# Altium schematic sheet Power regulators.SchDoc
size A; SheetNumber: 1
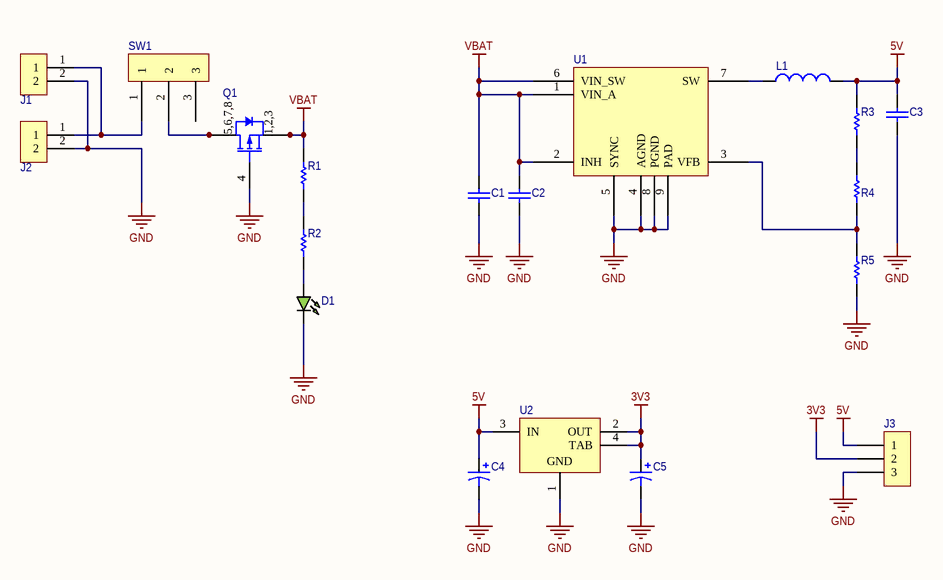
[diagram p0: Power regulators.SchDoc]

## Parts
C1  Kemet C1206C475K3RACAUTO  [CAPC3216X180X50ML20T25]  (value not drawn)
C2  Kemet C1206C104K5RACAUTO  [CAPC3216X88X50ML20T25]  (value not drawn)
C3  Kemet C1210C226K4PAC7800  [CAPC3225X205X50ML20T25]  (value not drawn)
C4  Cap Pol2  [PCB-2utroa4rb2vd9is4ckmk-1]  (value not drawn)
C5  Cap Pol2  [PCB-2utroa4rb2vd9is4ckmk-1]  (value not drawn)
D1  LTST-C170KGKT  [CHIPLED  0805]  (value not drawn)
J1  TE   647676-2  [PCB-kypnbpwjlxn1m6lvhwgg-1]  (value not drawn)
J2  TE   647676-2  [PCB-kypnbpwjlxn1m6lvhwgg-1]  (value not drawn)
J3  Molex 75757-0431  [Molex 75757-0431]  (value not drawn)
L1  RLF7030T-3R3M4R1  [INDC7922X32N]  (value not drawn)
Q1  SYM-000bc976ee97dfcc-1  [PCB-o8kpmntap7p5mqdjohts-1]  (value not drawn)
R1  Vishay Dale CRCW12061K00FKEB  [RESC3216X60X45ML10T20]  (value not drawn)
R2  Vishay Dale CRCW12061K00FKEB  [RESC3216X60X45ML10T20]  (value not drawn)
R3  Vishay CRCW1206100KFKEA  [PCB-76kjjvsvnrmyxpejc0rn-1]  (value not drawn)
R4  Vishay Dale CRCW12065K10FKEA  [RESC3216X60X45ML10T20]  (value not drawn)
R5  Vishay Dale CRCW120620K0FKTA  [RESC3216X60X45ML10T20]  (value not drawn)
SW1  Canal Components SL19-121  [PCB-btjqrve0936pn890qe86-1]  (value not drawn)
U1  ST1S10  [PCB-q7tc9tlrfg8r6x64pd1q-1]  (value not drawn)
U2  LM1117IMPX-3.3/NOPB  [MP04A_N]  (value not drawn)

## Nets
3V3: C5.1 J3.2 U2.2(OUT) U2.4(TAB)
5V: C3.1 C4.1 J3.1 L1.2 R3.2 U2.3(IN)
GND: C1.2 C2.2 C3.2 C4.2 C5.2 D1.1(K) J1.2 J2.2 J3.3 Q1.4(G) R5.2 U1.4(AGND) U1.5(SYNC) U1.8(PGND) U1.9(PAD) U2.1(GND)
VBAT: C1.1 C2.1 Q1.1(S) Q1.2(S) Q1.3(S) R1.1 U1.1(VIN_A) U1.2(INH) U1.6(VIN_SW)
NetD1_2: D1.2(A) R2.2
NetJ1_1: J1.1 J2.1 SW1.1
NetL1_1: L1.1 U1.7(SW)
NetQ1_5: Q1.5(D) Q1.6(D) Q1.7(D) Q1.8(D) SW1.2
NetR1_2: R1.2 R2.1
NetR3_1: R3.1 R4.2
NetR4_1: R4.1 R5.1 U1.3(VFB)

Not connected (* = marked no-connect by the designer): SW1 3

## Notes on the sheet
- (in symbol FDS4141) 5,6,7,8; 1,2,3

## Library data of the parts
C1 = C1206C475K3RACAUTO: CAPACITOR, 1206, X7R, 25V, 4.7UF; Capacitance: 4.7e-06 F; Capacitance Tolerance: ±10%; Dielectric Material: Ceramic; Lead-Free Status: R; Voltage Rating (DC): 25.0 V; Case/Package: 1206; Dielectric Characteristic: X7R; Mounting Style: Surface Mount; Octopart Url: https://octopart.com/c1206c475k3racauto-kemet-17603066; OctopartID: 7b3fb339c7a3a4f8; Packaging: Cut Tape (CT); REACH SVHC Compliance: No SVHC; RoHS: Compliant; Manufacturer Part Number: C1206C475K3RACAUTO
C2 = C1206C104K5RACAUTO: Cap Ceramic 0.1uF 50V X7R 10% SMD 1206 125C Plastic T/R; Capacitance: 1e-07 F; Lead-Free Status: R; Voltage Rating (DC): 50.0 V; Manufacturer Part Number: C1206C104K5RACAUTO; Capacitance Tolerance: ±10%; Case/Package: 1206; Dielectric Characteristic: X7R; Dielectric Material: Ceramic; Mounting Style: Surface Mount; Octopart Url: https://octopart.com/c1206c104k5racauto-kemet-12595586; OctopartID: 2beee2243f0af429; Packaging: Cut Tape (CT); REACH SVHC Compliance: No SVHC; RoHS: Compliant
C3 = C1210C226K4PACTU: Capacitor 1210 22uF 16V; Capacitance: 2.2e-05 F; Capacitance Tolerance: ±10%; Dielectric Characteristic: X5R; Dielectric Material: Ceramic; Lead-Free Status: Lead Free; Voltage Rating (DC): 16.0 V; Manufacturer Part Number: C1210C226K4PACTU; Case/Package: 1210; Mounting Style: Surface Mount; Octopart Url: https://octopart.com/c1210c226k4pac7800-kemet-11809228; OctopartID: aef0674eba5a7137; RoHS: Compliant
C4 C5 = T491C106K016AT4153: Cap Tant 10UF 10% 16V 2312
D1 = LTST-C170KGKT: Green 2 x 1.25 x 1.1 mm 130° Water Clear 35 mcd 2 V Surface Mount LED; Manufacturer: Lite-On; Case/Package (SI): 2012; Forward Voltage: 2.00 V; Lead-Free Status: Lead Free; Luminous Intensity: 35.0 mcd; Case/Package: 0805; Viewing Angle: 130 °; OctopartID: 4cca85c80a58930d; Manufacturer Part Number: LTST-C170KGKT; Size-Length: 2.00 mm; Size-Width: 1.25 mm; Octopart URL: https://octopart.com/ltst-c170kgkt-lite-on-549876
J1 J2 = 15EDGRC-3.5-02P-14: Pluggable terminal block; Colour: green; Mat: PA66; on PCBs; male; Contact Plating: Tin; Orientation: Right Angle; Manufacturer Part Number: 15EDGRC-3.5-02P-14; Flammability Rating: UL 94 V-0; Contact Material: Brass
J3 = CMP-6ec4a6b2c126b103-1: Conn Unshrouded Header HDR 3 POS 3.5mm Solder ST Thru-Hole Tube; Current Rating: 16.0 A; Glow Wire Compliant: Non-Compliant; Number of Circuits: 3; Mounting Style: Through Hole; Orientation: Vertical; Octopart URL: http://octopart.com/75757-0431-molex-24939140; Lifecycle Status: Active; Halogen Free Status: Low Halogen; OctopartID: 6ec4a6b2c126b103
L1 = RLF7030T-3R3M4R1: Inductor Power Shielded Wirewound 3.3uH 20% 100KHz Ferrite 4.1A 20.88mOhm DCR T/R; Inductance: 3.30 µH; Manufacturer Part Number: RLF7030T-3R3M4R1; Packaging: Tape & Reel (TR), Cut Tape (CT); Size-Width: 6.80 mm; Size-Length: 7.30 mm
Q1 = FDS4141: P-Channel 40 V 13 mOhm SMT PowerTrench® Mosfet - SOIC-8; Manufacturer Part Number: FDS4141
R1 R2 = CRCW12061K00FKEB: Thick Film Resistors - SMD 1/4watt 1Kohms 1%; Lead-Free Status: Lead Free; Power Rating: 0.25 W; Resistance: 1000.0 Ω; Voltage Rating (DC): 200.0 V; Case/Package: 1206; Number of Pins: 2; Octopart Url: https://octopart.com/crcw12061k00fkeb-vishay+dale-42466336; OctopartID: 6554aed9bc12ba93; Resistance Tolerance: ±1%; RoHS: Compliant; Manufacturer Part Number: CRCW12061K00FKEB
R3 = CRCW1206100KFKEA: Res Thick Film 1206 100K Ohm 1% 1/4W ±100ppm/°C Molded SMD SMD Paper T/R
R4 = CRCW12065K10FKEA: RES SMD 5.1K OHM 1% 1/4W 1206; Case/Package (SI): 3216; Lead-Free Status: Lead Free; Power Rating: 0.25 W; Resistance: 5100.0 Ω; Voltage Rating (DC): 200.0 V; Manufacturer Part Number: CRCW12065K10FKEA; Case/Package: 1206; Mounting Style: Surface Mount; Number of Pins: 2; Octopart Url: https://octopart.com/crcw12065k10fkea-vishay-39999519; OctopartID: afbf64d7d2c67078; REACH SVHC Compliance: No SVHC; Resistance Tolerance: ±1%; RoHS: Compliant; Size-Height: 0.00055 m; Size-Length: 0.0032 m; Size-Width: 0.0016 m
R5 = CRCW120620K0FKTA: RES SMD 20K OHM 1% 1/4W 1206; Case/Package (SI): 3216; Lead-Free Status: Contains Lead; Power Dissipation: 0.25 W; Resistance: 20000.0 Ω; Temperature Coefficient: 100.0 ppm/°C; Voltage Rating (DC): 200.0 V; Manufacturer Part Number: CRCW120620K0FKTA; Case/Package: 1206; Mounting Style: Surface Mount; Number of Pins: 2; Octopart Url: https://octopart.com/crcw120620k0fkta-vishay-46635441; OctopartID: d4d21f1f68050b15; Power Rating: 0.25 W; Resistance Tolerance: ±1%; RoHS: Non-Compliant; Size-Height: 0.00055 m; Size-Length: 0.0032 m; Size-Width: 0.0016 m
SW1 = SL19-121: Switch: slide; Positions: 2; SPDT; 3A/250VAC; 6A/28VDC; ON-ON; OctopartID: 2d08e78b94a7f2cf; Contact Plating: Silver; Octopart URL: http://octopart.com/sl19-121-canal+components-59350217; Contact Material: Copper; Mounting Style: Through Hole; Manufacturer Part Number: SL19-121
U1 = ST1S10PHR: ld1086dt33tr for waterspectr; Lead-Free Status: Lead Free; Output Current: 3.00 A; Packaging: Tape & Reel (TR), Cut Tape (CT); Mounting Style: Surface Mount; Manufacturer Part Number: ST1S10PHR; OctopartID: 3562fcc938a8eaa5; REACH SVHC Compliance: No SVHC; Lifecycle Status: Active; Operating Temperature: 125 °C (max)
U2 = LM1117IMPX-3.3/NOPB: 800mA Low-Dropout Linear Regulator, 4-pin SOT-223, Pb-Free; Dropout Voltage: 1.2 V; Lead-Free Status: Lead Free; Number of Regulated Outputs: 1; Output Capacitor Type: Tantalum; Output Current: 0.8 A; Output Voltage: 3.3 V; Quiescent Current: 0.005 A; Manufacturer Part Number: LM1117IMPX-3.3/NOPB; Lifecycle Status: Active; Number of Pins: 4; Octopart Url: https://octopart.com/lm1117impx-3.3%2Fnopb-texas+instruments-24812442; OctopartID: 57eb9f9be917882c; Packaging: Tape & Reel (TR); REACH SVHC Compliance: No SVHC; RoHS: Compliant